# Altium schematic sheet Sheet1.SchDoc
size A3
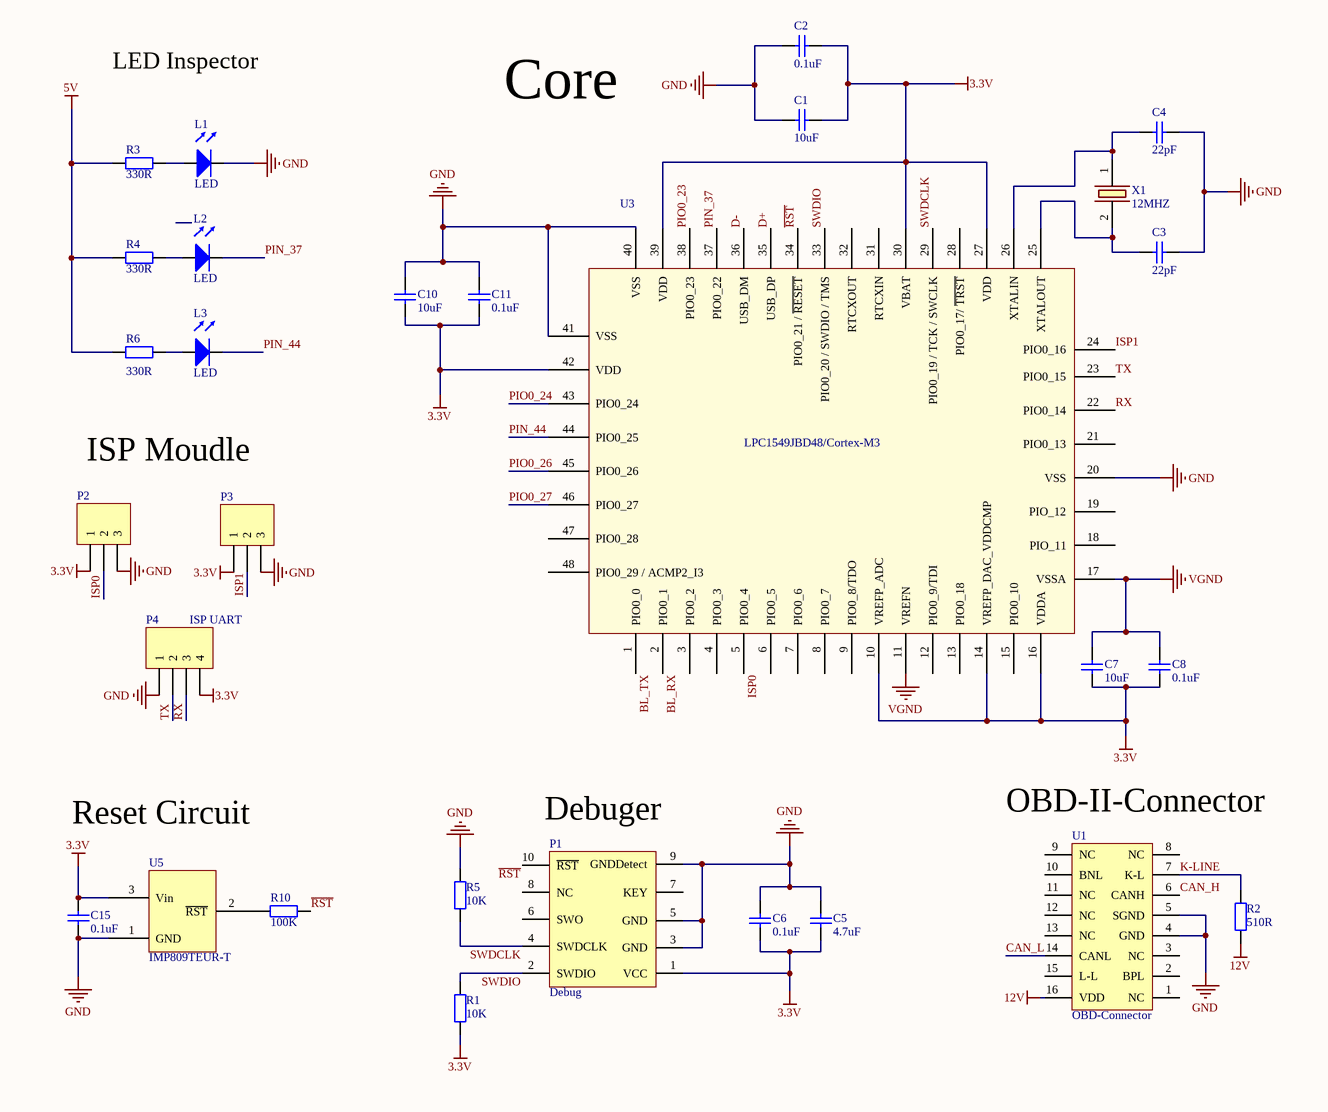
[diagram p0: Sheet1.SchDoc]

## Parts
C1  10uF  [0603]
C2  0.1uF  [0603]
C3  22pF  [0603]
C4  22pF  [0603]
C5  4.7uF  [0603]
C6  0.1uF  [0603]
C7  10uF  [0603]
C8  0.1uF  [0603]
C10  10uF  [0603]
C11  0.1uF  [0603]
C15  0.1uF  [0603]
L1  LED  [0805]
L2  LED  [0805]
L3  LED  [0805]
P1  Debug  [JATG_10pin]
P2  (no value)  [HDR1X3]
P3  (no value)  [HDR1X3]
P4  ISP UART  [HDR1X4]
R1  10K  [0603]
R2  510R  [0603]
R3  330R  [0603]
R4  330R  [0603]
R5  10K  [0603]
R6  330R  [0603]
R10  100K  [0603]
U1  OBD-Connector  [OBD-MaleConnector]
U3  LPC1549  [LPC1549JBD48]  (value not drawn)
U5  IMP809TEUR-T  [SOT23-3]
X1  12MHZ  [12Mhz-DFN]

## Nets
3.3V: C1.2 C2.2 C5.2 C6.2 C7.1 C8.1 C10.1 C11.1 C15.2 P1.1(VCC) P2.1 P3.1 P4.4 R1.1 U3.10(VREFP_ADC) U3.14(VREFP_DAC_VDDCMP) U3.16(VDDA) U3.27(VDD) U3.30(VBAT) U3.39(VDD) U3.42(VDD) U5.3(Vin)
5V: R3.1 R4.1 R6.1
12V: R2.1 U1.16(VDD)
GND: C1.1 C2.1 C3.2 C4.2 C5.1 C6.1 C10.2 C11.2 C15.1 L1.2(K) P1.3(GND) P1.5(GND) P1.9(GNDDetect) P2.3 P3.3 P4.1 R5.2 U1.4(GND) U1.5(SGND) U3.20(VSS) U3.40(VSS) U3.41(VSS) U5.1(GND)
VGND: C7.2 C8.2 U3.11(VREFN) U3.17(VSSA)
BL_RX: U3.2(PIO0_1)
BL_TX: U3.1(PIO0_0)
CAN_H: U1.6(CANH)
CAN_L: U1.14(CANL)
D+: U3.35(USB_DP)
D-: U3.36(USB_DM)
ISP0: P2.2 U3.5(PIO0_4)
ISP1: P3.2 U3.24(PIO0_16)
K-LINE: R2.2 U1.7(K-L)
PIN_37: L2.2(K) U3.37(PIO0_22)
PIN_44: L3.2(K) U3.44(PIO0_25)
PIO0_23: U3.38(PIO0_23)
PIO0_24: U3.43(PIO0_24)
PIO0_26: U3.45(PIO0_26)
PIO0_27: U3.46(PIO0_27)
~{RST}: P1.10(~{RST}) R10.1 U3.34(PIO0_21_/_~{RESET})
RX: P4.3 U3.22(PIO0_14)
SWDCLK: P1.4(SWDCLK) R5.1 U3.29(PIO0_19_/_TCK_/_SWCLK)
SWDIO: P1.2(SWDIO) R1.2 U3.33(PIO0_20_/_SWDIO_/_TMS)
TX: P4.2 U3.23(PIO0_15)
NetC3_1: C3.1 U3.25(XTALOUT) X1.2
NetC4_1: C4.1 U3.26(XTALIN) X1.1
NetL1_1: L1.1(A) R3.2
NetL2_1: L2.1(A) R4.2
NetL3_1: L3.1(A) R6.2
NetR10_2: R10.2 U5.2(~{RST})

Not connected (* = marked no-connect by the designer): P1 6(SWO) 7(KEY) 8(NC); U1 1(NC) 2(BPL) 3(NC) 8(NC) 9(NC) 10(BNL) 11(NC) 12(NC) 13(NC) 15(L-L); U3 3(PIO0_2) 4(PIO0_3) 6(PIO0_5) 7(PIO0_6) 8(PIO0_7) 9(PIO0_8/TDO) 12(PIO0_9/TDI) 13(PIO0_18) 15(PIO0_10) 18(PIO_11) 19(PIO_12) 21(PIO0_13) 28(PIO0_17/_~{TRST}) 31(RTCXIN) 32(RTCXOUT) 47(PIO0_28) 48(PIO0_29_/_ACMP2_I3)

## Notes on the sheet
- LED Inspector
- Core
- ISP Moudle
- Reset Circuit
- (near P1) Debuger
- (near U1) OBD-II-Connector
- (in symbol LPC1549JBD48) LPC1549JBD48/Cortex-M3

## Library data of the parts
C1-C8 C10 C11 C15 = Cap1: ceramic
P1 = JTAG_10Pin
P2 P3 = Header 3: Header, 3-Pin; LatestRevisionDate: 17-Jul-2002; LatestRevisionNote: Re-released for DXP Platform.; Publisher: Altium Limited
P4 = Header 4: Header, 4-Pin; LatestRevisionDate: 17-Jul-2002; LatestRevisionNote: Re-released for DXP Platform.; Publisher: Altium Limited
R1-R6 R10 = Res
U1 = OBD-MaleHead
U3 = LPC1549JBD48
X1 = OSC